# EAGLE schematic Placa de Cima (EAGLE 9.3.0)
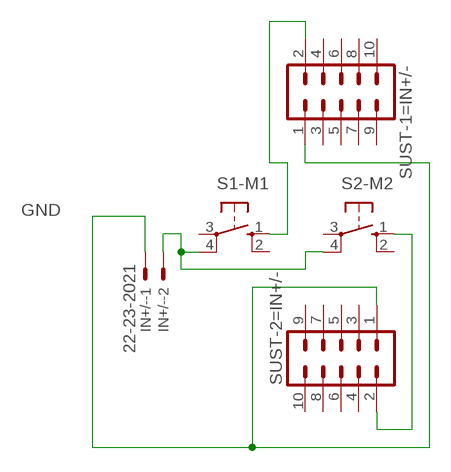
[diagram p0: schematic, sheet 1]

## Parts
IN+/-  22-23-2021  [22-23-2021]
S1-M1  10-XX  [B3F-10XX]
S2-M2  10-XX  [B3F-10XX]
SUST-1=IN+/-  MA05-2  [MA05-2]
SUST-2=IN+/-  MA05-2  [MA05-2]

## Nets
GND: IN+/-.1 SUST-1=IN+/-.1 SUST-2=IN+/-.1
N$1: S1-M1.1(S) SUST-1=IN+/-.2
N$2: S2-M2.1(S) SUST-2=IN+/-.2
N$3: IN+/-.2 S1-M1.4(P1) S2-M2.4(P1)
Unconnected: S1-M1.2(S1) S1-M1.3(P) S2-M2.2(S1) S2-M2.3(P) SUST-1=IN+/-.3 SUST-1=IN+/-.4 SUST-1=IN+/-.5 SUST-1=IN+/-.6 SUST-1=IN+/-.7 SUST-1=IN+/-.8 SUST-1=IN+/-.9 SUST-1=IN+/-.10 SUST-2=IN+/-.3 SUST-2=IN+/-.4 SUST-2=IN+/-.5 SUST-2=IN+/-.6 SUST-2=IN+/-.7 SUST-2=IN+/-.8 SUST-2=IN+/-.9 SUST-2=IN+/-.10

## Library data of the parts
IN+/- = con-molex:22-23-2021: .100" (2.54mm) Center Header - 2 Pin; MF: MOLEX; MPN: 22-23-2021; OC_FARNELL: 1462926; OC_NEWARK: 25C3832
S1-M1 S2-M2 = switch-omron:10-XX: OMRON SWITCH; MPN: B3F-1000; OC_FARNELL: 176432; OC_NEWARK: 36M3542
SUST-1=IN+/- SUST-2=IN+/- = con-lstb:MA05-2: PIN HEADER; OC_FARNELL: unknown; OC_NEWARK: unknown